# Altium schematic sheet nrf52840.SchDoc: nRF52840
size A; DocumentNumber: 1; Revision: 0.0.1; SheetNumber: 2; SheetTotal: 4
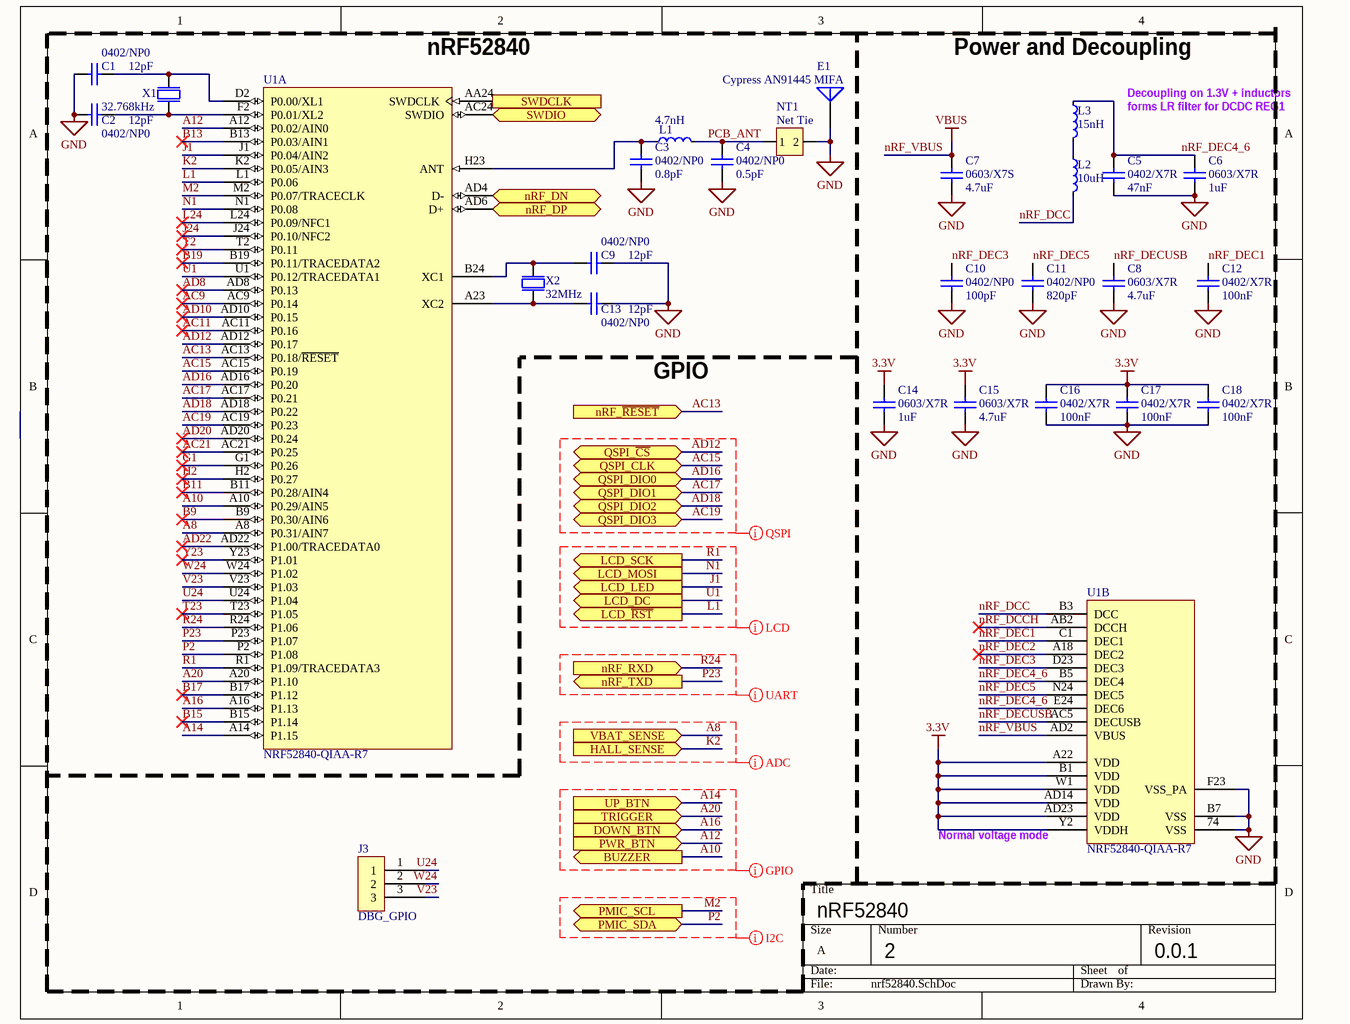
[diagram p0: nrf52840.SchDoc]

## Parts
C1  0402/NP0  value 12pF  [CAPC1005X04L]
C2  0402/NP0  value 12pF  [CAPC1005X04L]
C3  0402/NP0  value 0.8pF  [CAPC1005X04L]
C4  0402/NP0  value 0.5pF  [CAPC1005X04L]
C5  0402/X7R  value 47nF  [CAPC1005X04L]
C6  0603/X7R  value 1uF  [CAPC1608X06L]
C7  0603/X7S  value 4.7uF  [CAPC1608X06L]
C8  0603/X7R  value 4.7uF  [CAPC1608X06L]
C9  0402/NP0  value 12pF  [CAPC1005X04L]
C10  0402/NP0  value 100pF  [CAPC1005X04L]
C11  0402/NP0  value 820pF  [CAPC1005X04L]
C12  0402/X7R  value 100nF  [CAPC1005X04L]
C13  0402/NP0  value 12pF  [CAPC1005X04L]
C14  0603/X7R  value 1uF  [CAPC1608X06L]
C15  0603/X7R  value 4.7uF  [CAPC1608X06L]
C16  0402/X7R  value 100nF  [CAPC1005X04L]
C17  0402/X7R  value 100nF  [CAPC1005X04L]
C18  0402/X7R  value 100nF  [CAPC1005X04L]
E1  Cypress AN91445 MIFA  [Cypress_AN91445_MIFA]
J3  DBG_GPIO  [DBG_Header]
L1  4.7nH  [INDC1005X04L]
L2  10uH  [INDC1608X06L]
L3  15nH  [INDC1005X04L]
NT1  Net Tie  [MIFA_NET_TIE]  (net tie, no BOM)
U1  NRF52840-QIAA-R7  [AQFN50P700X700X85_HS-74N]  (parts A,B of 2)
X1  32.768kHz  [XTAL_3215]
X2  32MHz  [BT-XTAL_2016]

## Ports
BUZZER (out), DOWN_BTN (in), HALL_SENSE (in), LCD_DC (out), LCD_LED (out), LCD_MOSI (out), LCD_SCK (out), LCD_~{RST} (out), nRF_DN (bidir), nRF_DP (bidir), nRF_RXD (in), nRF_TXD (out), nRF_~{RESET} (in), PMIC_SCL (out), PMIC_SDA (bidir), PWR_BTN (in), QSPI_CLK (bidir), QSPI_DIO0 (bidir), QSPI_DIO1 (bidir), QSPI_DIO2 (bidir), QSPI_DIO3 (bidir), QSPI_~{CS} (bidir), SWDCLK (in), SWDIO (bidir), TRIGGER (in), UP_BTN (in), VBAT_SENSE (in)

## Nets
3.3V: C14.1 C15.1 C16.1 C17.1 C18.2 U1.A22(VDD) U1.AD14(VDD) U1.AD23(VDD) U1.B1(VDD) U1.W1(VDD) U1.Y2(VDDH)
GND: C1.2 C2.2 C3.2 C4.2 C5.2 C6.2 C7.2 C8.2 C9.1 C10.2 C11.2 C12.2 C13.1 C14.2 C15.2 C16.2 C17.2 C18.1 E1.1 NT1.2 U1.74(VSS) U1.B7(VSS) U1.F23(VSS_PA) X2.2(GND) X2.4(GND)
nRF_VBUS: C7.1 U1.AD2(VBUS)  [also labelled VBUS]
A8: U1.A8(P0.31/AIN7) ; port VBAT_SENSE
A10: U1.A10(P0.29/AIN5) ; port BUZZER
A12: U1.A12(P0.02/AIN0) ; port PWR_BTN
A14: U1.A14(P1.15) ; port UP_BTN
A16: U1.A16(P1.13) ; port DOWN_BTN
A20: U1.A20(P1.10) ; port TRIGGER
AC9: U1.AC9(P0.14)
AC11: U1.AC11(P0.16)
AC13: U1.AC13(P0.18/~{RESET}) ; port nRF_~{RESET}
AC15: U1.AC15(P0.19) ; port QSPI_CLK
AC17: U1.AC17(P0.21) ; port QSPI_DIO1
AC19: U1.AC19(P0.23) ; port QSPI_DIO3
AC21: U1.AC21(P0.25)
AD8: U1.AD8(P0.13)
AD10: U1.AD10(P0.15)
AD12: U1.AD12(P0.17) ; port QSPI_~{CS}
AD16: U1.AD16(P0.20) ; port QSPI_DIO0
AD18: U1.AD18(P0.22) ; port QSPI_DIO2
AD20: U1.AD20(P0.24)
AD22: U1.AD22(P1.00/TRACEDATA0)
B9: U1.B9(P0.30/AIN6)
B11: U1.B11(P0.28/AIN4)
B13: U1.B13(P0.03/AIN1)
B15: U1.B15(P1.14)
B17: U1.B17(P1.12)
B19: U1.B19(P0.11/TRACEDATA2)
G1: U1.G1(P0.26)
H2: U1.H2(P0.27)
J1: U1.J1(P0.04/AIN2) ; port LCD_LED
J24: U1.J24(P0.10/NFC2)
K2: U1.K2(P0.05/AIN3) ; port HALL_SENSE
L1: U1.L1(P0.06) ; port LCD_~{RST}
L24: U1.L24(P0.09/NFC1)
M2: U1.M2(P0.07/TRACECLK) ; port PMIC_SCL
N1: U1.N1(P0.08) ; port LCD_MOSI
nRF_DCC: L2.2 U1.B3(DCC)
nRF_DCCH: U1.AB2(DCCH)
nRF_DEC1: C12.1 U1.C1(DEC1)
nRF_DEC2: U1.A18(DEC2)
nRF_DEC3: C10.1 U1.D23(DEC3)
nRF_DEC4_6: C5.1 C6.1 L3.1 U1.B5(DEC4) U1.E24(DEC6)
nRF_DEC5: C11.1 U1.N24(DEC5)
nRF_DECUSB: C8.1 U1.AC5(DECUSB)
nRF_DN: U1.AD4(D-) ; port nRF_DN
nRF_DP: U1.AD6(D+) ; port nRF_DP
P2: U1.P2(P1.08) ; port PMIC_SDA
P23: U1.P23(P1.07) ; port nRF_TXD
PCB_ANT: C4.1 L1.2 NT1.1
R1: U1.R1(P1.09/TRACEDATA3) ; port LCD_SCK
R24: U1.R24(P1.06) ; port nRF_RXD
SWDCLK: U1.AA24(SWDCLK) ; port SWDCLK
SWDIO: U1.AC24(SWDIO) ; port SWDIO
T2: U1.T2(P0.11)
T23: U1.T23(P1.05)
U1: U1.U1(P0.12/TRACEDATA1) ; port LCD_DC
U24: J3.1 U1.U24(P1.04)
V23: J3.3 U1.V23(P1.03)
W24: J3.2 U1.W24(P1.02)
Y23: U1.Y23(P1.01)
NetC1_1: C1.1 U1.D2(P0.00/XL1) X1.2(out)
NetC2_1: C2.1 U1.F2(P0.01/XL2) X1.1(inp)
NetC3_1: C3.1 L1.1 U1.H23(ANT)
NetC9_2: C9.2 U1.B24(XC1) X2.1(inp)
NetC13_2: C13.2 U1.A23(XC2) X2.3(out)
NetL2_1: L2.1 L3.2

## Layout directives
net class QSPI: AC15, AC17, AC19, AD12, AD16, AD18
net class LCD: J1, L1, N1, R1, U1
net class UART: A8, A10, A12, A14, A16, A20, K2, M2, P2, P23, R24

## Notes on the sheet
- (near U1) nRF52840
- (near L3) Power and Decoupling
- Decoupling on 1.3V + inductors
- forms LR filter for DCDC REG1
- GPIO
- (near U1) Normal voltage mode

## Library data of the parts
C1-C18 = Cap: Capacitor; Published: 8-Jun-2000; LatestRevisionDate: 17-Jul-2002; LatestRevisionNote: Re-released for DXP Platform.; PackageReference: RAD-0.3; Publisher: Altium Limited; PackageDescription: Radial Cap, Thru-Hole; 2 Leads; 0.3 in Pin Spacing; ComponentLink1Description: Digikey
  C1 C2 C9 C13: ComponentLink1URL: https://www.digikey.com/product-detail/en/walsin-technology-corporation/0402N120G500CT/1292-1250-1-ND/9355254
  C3: ComponentLink1URL: https://www.digikey.com/product-detail/en/johanson-technology-inc/500R07S0R8AV4T/712-1604-1-ND/6612940
  C4: ComponentLink1URL: https://www.digikey.com/product-detail/en/johanson-technology-inc/500R07S0R5AV4T/712-1247-1-ND/1786709
  C5: ComponentLink1URL: https://www.digikey.com/product-detail/en/w-rth-elektronik/885012205035/732-7530-1-ND/5454157
  C6 C14: ComponentLink1URL: https://www.digikey.com/product-detail/en/avx-corporation/0603YC105JAT2A/478-10814-1-ND/7536449
  C7: ComponentLink1URL: https://www.digikey.com/product-detail/en/tdk-corporation/C1608X7S1A475K080AC/445-14258-1-ND/3955924
  C8 C15: ComponentLink1URL: https://www.digikey.com/product-detail/en/samsung-electro-mechanics/CL10B475KQ8NQNC/1276-2087-1-ND/3890173
  C10: ComponentLink1URL: https://www.digikey.com/product-detail/en/samsung-electro-mechanics/CL05C101JB5NNNC/1276-1025-1-ND/3889111
  C11: ComponentLink1URL: https://www.digikey.com/product-detail/en/samsung-electro-mechanics/CL05C821JB5NNNC/1276-1727-1-ND/3889813
  C12 C16-C18: ComponentLink1URL: https://www.digikey.com/product-detail/en/w-rth-elektronik/885012205037/732-7532-1-ND/5454159
E1 = MIFA
J3 = Debug_Header
L1-L3 = IND_0402: High frequency chip inductor ±5%; Part Number: L0402-3n9; LatestRevisionDate: 2012-09-19; Pin Count: 2; Publisher: Nordic Semiconductor; Published: 2009-05-08; Note: High frequency chip inductor ±5%; Footprint Doc: 0402; ComponentLink1Description: Digikey
  L1: Value: 4.7nH; ComponentLink1URL: https://www.digikey.com/product-detail/en/delta-electronics-components/0402HC-4N7ECTS/2035-1346-1-ND/10135917
  L2: Value: 10uH; ComponentLink1URL: https://www.digikey.com/product-detail/en/tdk-corporation/MLZ1608M100WT000/445-6389-1-ND/2465716
  L3: Value: 15nH; ComponentLink1URL: https://www.digikey.com/product-detail/en/kemet/L0402C15NJRMST/399-9557-1-ND/3674135
NT1 = MIFA_NET_TIE
U1 = NRSC-NRF52840-AQFN-73: RF System on a Chip, 1.7 to 3.6 V, -40 to 85 degC, 73-Pin AQFN, RoHS, Tape and Reel; Manufacturer: Nordic Semiconductor; Package Description: 73-Pin Array Quad Flat No-lead Package, Body 7 x 7 mm, Pitch 0.5 mm; Datasheet Version: Rev. 0.5.1, 07/2017; RoHSCompliant: false; Mounting Technology: SurfaceMount; Manufacturer URL: http://www.nordicsemi.com/eng/Products/; Datasheet URL: http://infocenter.nordicsemi.com/pdf/nRF52840_OPS_v0.5.1.pdf; Package Reference: AQFN
X1 = XTAL_SMD3215: XTAL SMD 3215, 32.768kHz, Cl=9pF, Total Tol: ±50ppm; Part Number: XTAL_SMD3215_32.768kHz_9pF_General; LatestRevisionDate: 2016-08-19; Pin Count: 2; Publisher: Nordic Semiconductor; Published: 2016-08-19; Value: 32.768kHz; Footprint Doc: XTAL_3215; ComponentLink1Description: Digikey; ComponentLink1URL: https://lcsc.com/product-detail/SMD-Crystal-Resonators_JGHC-S3132768092070_C479190.html
X2 = XTAL_SMD2016: XTAL SMD 2016, 32MHz, Cl=8pF, Total Tol: ±40ppm; Part Number: XTAL_SMD2016_32MHz_8pF_General; LatestRevisionDate: 2016-08-19; Pin Count: 4; Publisher: Nordic Semiconductor; Published: 2016-08-19; Value: 32MHz; Footprint Doc: XTAL_2016; ComponentLink1Description: Digikey; ComponentLink1URL: https://www.digikey.com/product-detail/en/ecs-inc/ECS-320-8-37B-CKY-TR/XC3067CT-ND/9838882; ComponentLink2Description: Datasheet; ComponentLink2URL: https://ecsxtal.com/store/pdf/ECX-1637B.pdf